# Altium schematic sheet Memory.SchDoc
size A3; SheetNumber: 6; SheetTotal: 13
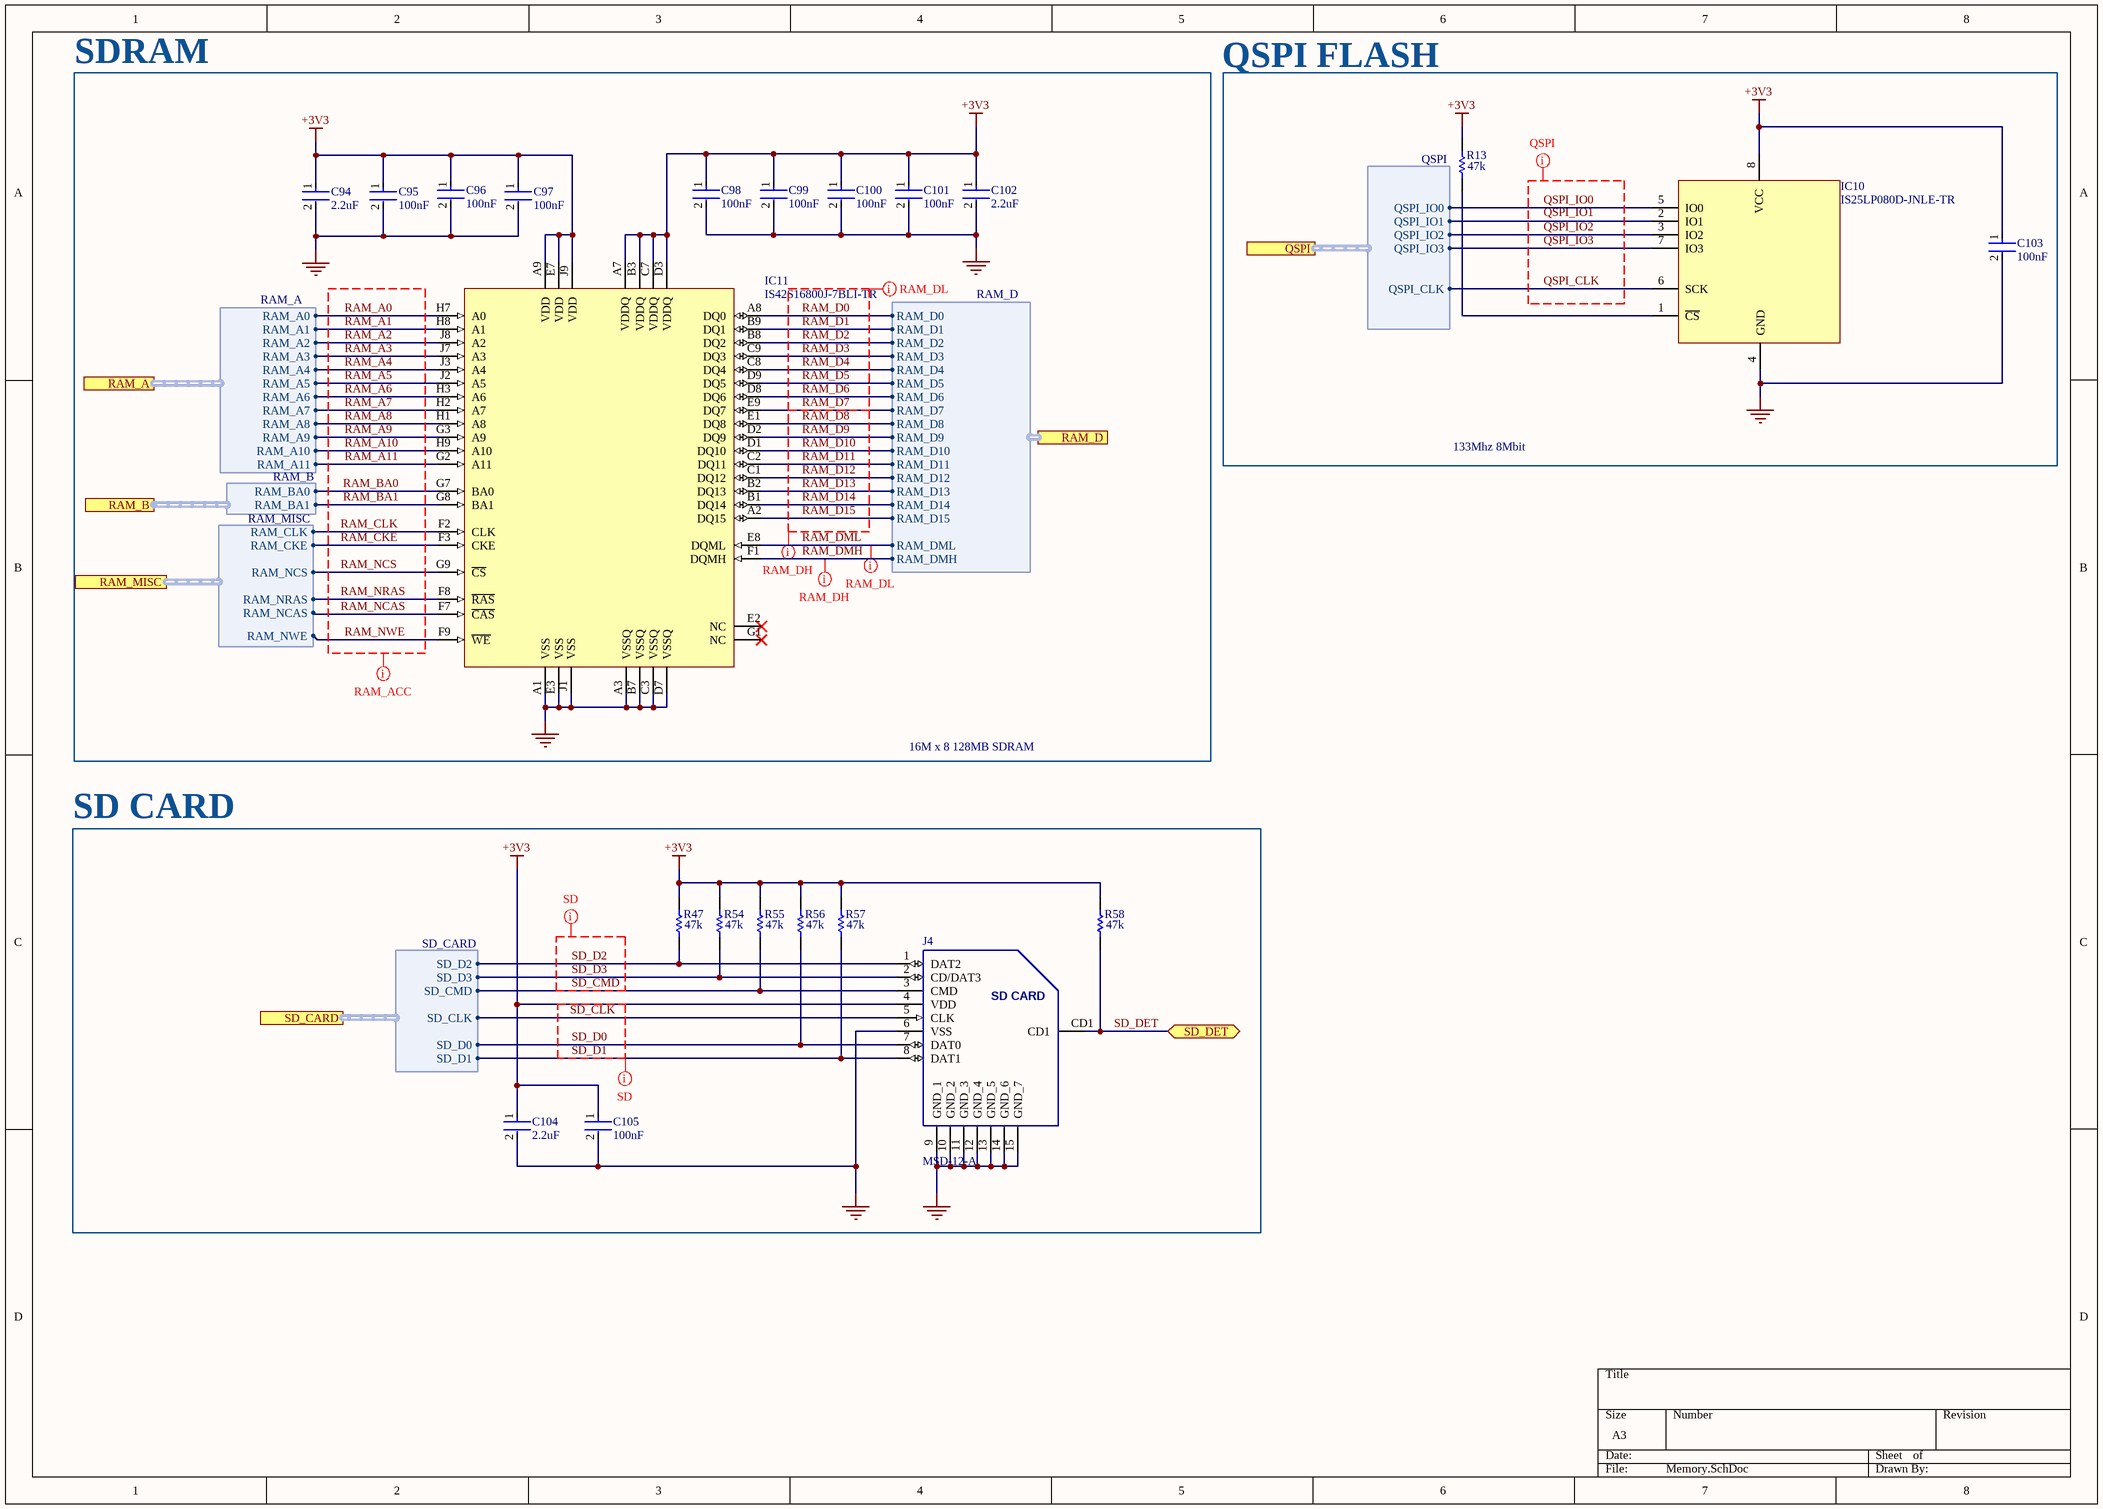
[diagram p0: Memory.SchDoc]

## Parts
C94  Capacitance: 2.2uF  [FP-GCH188-0_1-e0_2_0_5-MFG]  (hidden comment: GCM188C71A225KE02D)
C95  Capacitance: 100nF  [FP-GCM155-0_05-IPC_A]  (hidden comment: GCM155R71H104ME02J)
C96  Capacitance: 100nF  [FP-GCM155-0_05-IPC_A]  (hidden comment: GCM155R71H104ME02J)
C97  Capacitance: 100nF  [FP-GCM155-0_05-IPC_A]  (hidden comment: GCM155R71H104ME02J)
C98  Capacitance: 100nF  [FP-GCM155-0_05-IPC_A]  (hidden comment: GCM155R71H104ME02J)
C99  Capacitance: 100nF  [FP-GCM155-0_05-IPC_A]  (hidden comment: GCM155R71H104ME02J)
C100  Capacitance: 100nF  [FP-GCM155-0_05-IPC_A]  (hidden comment: GCM155R71H104ME02J)
C101  Capacitance: 100nF  [FP-GCM155-0_05-IPC_A]  (hidden comment: GCM155R71H104ME02J)
C102  Capacitance: 2.2uF  [FP-GCH188-0_1-e0_2_0_5-MFG]  (hidden comment: GCM188C71A225KE02D)
C103  Capacitance: 100nF  [FP-GCM155-0_05-IPC_A]  (hidden comment: GCM155R71H104ME02J)
C104  Capacitance: 2.2uF  [FP-GCH188-0_1-e0_2_0_5-MFG]  (hidden comment: GCM188C71A225KE02D)
C105  Capacitance: 100nF  [FP-GCM155-0_05-IPC_A]  (hidden comment: GCM155R71H104ME02J)
IC10  IS25LP080D-JNLE-TR  [SOIC127P600X175-8N]
IC11  IS42S16800J-7BLI-TR  [IS42S16800J-7BLI-TR]
J4  MSD-12-A  [MSD12A]
R13  Resistance: 47k  [RESC1005X40X25LL05T10]  (hidden comment: RC0402JR-0747KL)
R47  Resistance: 47k  [RESC1005X40X25LL05T10]  (hidden comment: RC0402JR-0747KL)
R54  Resistance: 47k  [RESC1005X40X25LL05T10]  (hidden comment: RC0402JR-0747KL)
R55  Resistance: 47k  [RESC1005X40X25LL05T10]  (hidden comment: RC0402JR-0747KL)
R56  Resistance: 47k  [RESC1005X40X25LL05T10]  (hidden comment: RC0402JR-0747KL)
R57  Resistance: 47k  [RESC1005X40X25LL05T10]  (hidden comment: RC0402JR-0747KL)
R58  Resistance: 47k  [RESC1005X40X25LL05T10]  (hidden comment: RC0402JR-0747KL)

## Blocks framed on the sheet
SDRAM: C94-C102 IC11
QSPI FLASH: C103 IC10 R13
SD CARD: C104 C105 J4 R47 R54-R58

## Ports
QSPI (harness QSPI, see high_level[3A], MCU_Connections[4B]), RAM_A (harness RAM_A, see high_level[3A], MCU_Connections[2B]), RAM_B (harness RAM_B, see high_level[3A], MCU_Connections[2C]), RAM_D (harness RAM_D, see high_level[3A], MCU_Connections[2D]), RAM_MISC (harness RAM_MISC, see high_level[3A], MCU_Connections[2C]), SD_CARD (harness SD_CARD, see high_level[3A], MCU_Connections[4C]), SD_DET (bidir, see high_level[3A], MCU_Connections[5C])

## Harnesses
RAM_D: RAM_D0, RAM_D1, RAM_D2, RAM_D3, RAM_D4, RAM_D5, RAM_D6, RAM_D7, RAM_D8, RAM_D9, RAM_D10, RAM_D11, RAM_D12, RAM_D13, RAM_D14, RAM_D15, RAM_DML, RAM_DMH
RAM_A: RAM_A0, RAM_A1, RAM_A2, RAM_A3, RAM_A4, RAM_A5, RAM_A6, RAM_A7, RAM_A8, RAM_A9, RAM_A10, RAM_A11
RAM_B: RAM_BA0, RAM_BA1
RAM_MISC: RAM_CLK, RAM_CKE, RAM_NCS, RAM_NRAS, RAM_NCAS, RAM_NWE
SD_CARD: SD_D2, SD_D3, SD_CMD, SD_CLK, SD_D0, SD_D1
QSPI: QSPI_IO0, QSPI_IO1, QSPI_IO2, QSPI_IO3, QSPI_CLK

## Nets
+3V3: C94.1 C95.1 C96.1 C97.1 C98.1 C99.1 C100.1 C101.1 C102.1 C103.1 C104.1 C105.1 IC10.8(VCC) IC11.A7(VDDQ) IC11.A9(VDD) IC11.B3(VDDQ) IC11.C7(VDDQ) IC11.D3(VDDQ) IC11.E7(VDD) IC11.J9(VDD) J4.4(VDD) R13.2 R47.2 R54.2 R55.2 R56.2 R57.2 R58.2
GND: C94.2 C95.2 C96.2 C97.2 C98.2 C99.2 C100.2 C101.2 C102.2 C103.2 C104.2 C105.2 IC10.4(GND) IC11.A1(VSS) IC11.A3(VSSQ) IC11.B7(VSSQ) IC11.C3(VSSQ) IC11.D7(VSSQ) IC11.E3(VSS) IC11.J1(VSS) J4.6(VSS) J4.9(GND_1) J4.10(GND_2) J4.11(GND_3) J4.12(GND_4) J4.13(GND_5) J4.14(GND_6) J4.15(GND_7)
QSPI_CLK: IC10.6(SCK) ; port QSPI.QSPI_CLK
QSPI_IO0: IC10.5(IO0) ; port QSPI.QSPI_IO0
QSPI_IO2: IC10.3(IO2) ; port QSPI.QSPI_IO2
QSPI_IO3: IC10.7(IO3) ; port QSPI.QSPI_IO3
RAM_A0: IC11.H7(A0) ; port RAM_A.RAM_A0
RAM_A1: IC11.H8(A1) ; port RAM_A.RAM_A1
RAM_A2: IC11.J8(A2) ; port RAM_A.RAM_A2
RAM_A3: IC11.J7(A3) ; port RAM_A.RAM_A3
RAM_A4: IC11.J3(A4) ; port RAM_A.RAM_A4
RAM_A5: IC11.J2(A5) ; port RAM_A.RAM_A5
RAM_A6: IC11.H3(A6) ; port RAM_A.RAM_A6
RAM_A7: IC11.H2(A7) ; port RAM_A.RAM_A7
RAM_A8: IC11.H1(A8) ; port RAM_A.RAM_A8
RAM_A9: IC11.G3(A9) ; port RAM_A.RAM_A9
RAM_A10: IC11.H9(A10) ; port RAM_A.RAM_A10
RAM_A11: IC11.G2(A11) ; port RAM_A.RAM_A11
RAM_BA0: IC11.G7(BA0) ; port RAM_B.RAM_BA0
RAM_BA1: IC11.G8(BA1) ; port RAM_B.RAM_BA1
RAM_CKE: IC11.F3(CKE) ; port RAM_MISC.RAM_CKE
RAM_CLK: IC11.F2(CLK) ; port RAM_MISC.RAM_CLK
RAM_D0: IC11.A8(DQ0) ; port RAM_D.RAM_D0
RAM_D1: IC11.B9(DQ1) ; port RAM_D.RAM_D1
RAM_D2: IC11.B8(DQ2) ; port RAM_D.RAM_D2
RAM_D3: IC11.C9(DQ3) ; port RAM_D.RAM_D3
RAM_D4: IC11.C8(DQ4) ; port RAM_D.RAM_D4
RAM_D5: IC11.D9(DQ5) ; port RAM_D.RAM_D5
RAM_D6: IC11.D8(DQ6) ; port RAM_D.RAM_D6
RAM_D7: IC11.E9(DQ7) ; port RAM_D.RAM_D7
RAM_D8: IC11.E1(DQ8) ; port RAM_D.RAM_D8
RAM_D9: IC11.D2(DQ9) ; port RAM_D.RAM_D9
RAM_D10: IC11.D1(DQ10) ; port RAM_D.RAM_D10
RAM_D11: IC11.C2(DQ11) ; port RAM_D.RAM_D11
RAM_D12: IC11.C1(DQ12) ; port RAM_D.RAM_D12
RAM_D13: IC11.B2(DQ13) ; port RAM_D.RAM_D13
RAM_D14: IC11.B1(DQ14) ; port RAM_D.RAM_D14
RAM_D15: IC11.A2(DQ15) ; port RAM_D.RAM_D15
RAM_DMH: IC11.F1(DQMH) ; port RAM_D.RAM_DMH
RAM_DML: IC11.E8(DQML) ; port RAM_D.RAM_DML
RAM_NCAS: IC11.F7(~{CAS}) ; port RAM_MISC.RAM_NCAS
RAM_NCS: IC11.G9(~{CS}) ; port RAM_MISC.RAM_NCS
RAM_NRAS: IC11.F8(~{RAS}) ; port RAM_MISC.RAM_NRAS
RAM_NWE: IC11.F9(~{WE}) ; port RAM_MISC.RAM_NWE
SD_CLK: J4.5(CLK) ; port SD_CARD.SD_CLK
SD_CMD: J4.3(CMD) R55.1 ; port SD_CARD.SD_CMD
SD_D0: J4.7(DAT0) R56.1 ; port SD_CARD.SD_D0
SD_D1: J4.8(DAT1) R57.1 ; port SD_CARD.SD_D1
SD_D2: J4.1(DAT2) R47.1 ; port SD_CARD.SD_D2
SD_D3: J4.2(CD/DAT3) R54.1 ; port SD_CARD.SD_D3
SD_DET: J4.CD1 R58.1 ; port SD_DET
NetIC10_1: IC10.1(~{CS}) R13.1
NetIC10_2: IC10.2(IO1) ; port QSPI.QSPI_IO1

Not connected (* = marked no-connect by the designer): IC11 E2(NC)* G1(NC)*

## Layout directives
mark named RAM_ACC: RAM_A0, RAM_A1, RAM_A2, RAM_A3, RAM_A4, RAM_A5, RAM_A6, RAM_A7, RAM_A8, RAM_A9, RAM_A10, RAM_A11, RAM_BA0, RAM_BA1, RAM_CKE, RAM_CLK, RAM_NCAS, RAM_NCS, RAM_NRAS, RAM_NWE
mark named RAM_DL: RAM_D0, RAM_D1, RAM_D2, RAM_D3, RAM_D4, RAM_D5, RAM_D6, RAM_D7, RAM_DML
mark named RAM_DH: RAM_D7, RAM_D8, RAM_D9, RAM_D10, RAM_D11, RAM_D12, RAM_D13, RAM_D14, RAM_D15, RAM_DMH
mark named QSPI: QSPI_CLK, QSPI_IO0, QSPI_IO1, QSPI_IO2, QSPI_IO3
mark named SD: SD_CMD, SD_D1, SD_D2, SD_D3

## Notes on the sheet
- 133Mhz 8Mbit
- 16M x 8 128MB SDRAM
- Labels drawn without touching a wire or pin: QSPI_IO1
- (in symbol MSD-12-A) SD CARD

## Library data of the parts
C94 C102 C104 = CMP-00260-57357036-1: GCM188C71A225KE02D Multilayer Ceramic Capacitor, 2.2 uF, 10 V, ± 10%, X7S, 0603 [1608 Metric]; NexarPartId: 57357036; RoHS: Non-Compliant; Lifecycle Status: Production
C95-C101 C103 C105 = CMP-06035-028957-1: Ceramic Capacitor for Automotive 100nF ±20% 50VDC X7R 0402 Paper T/R
IC10 = IS25LP080D-JNLE-TR: Integrated Circuit; Manufacturer_Name: Integrated Silicon Solution Inc.; Datasheet Link: https://www.mouser.com/datasheet/2/198/25LP-WP080D-1003192.pdf; Height: 1.75mm; Manufacturer_Part_Number: IS25LP080D-JNLE-TR; Mouser Part Number: 870-IS25LP080DJNLETR; Mouser Price/Stock: https://www.mouser.co.uk/ProductDetail/ISSI/IS25LP080D-JNLE-TR?qs=pif5%252B9MYt0VkH9msMJ5aTQ%3D%3D; Arrow Part Number: IS25LP080D-JNLE-TR; Arrow Price/Stock: https://www.arrow.com/en/products/is25lp080d-jnle-tr/integrated-silicon-solution-inc?region=nac
IC11 = IS42S16800J-7BLI-TR: Integrated Circuit; Manufacturer_Name: Integrated Silicon Solution Inc.; Datasheet Link: https://www.mouser.be/datasheet/2/198/42_45S81600J_16800J-3460583.pdf; Height: 1.2mm; Manufacturer_Part_Number: IS42S16800J-7BLI-TR
J4 = MSD-12-A: Connector; Manufacturer_Name: Same Sky; Datasheet Link: https://www.sameskydevices.com/product/resource/MSD-12-A.pdf; Height: 1.6mm; Manufacturer_Part_Number: MSD-12-A; Mouser Part Number: 179-MSD-12-A; Mouser Price/Stock: https://www.mouser.co.uk/ProductDetail/Same-Sky/MSD-12-A?qs=Z%252BL2brAPG1KTGgvYejyeAQ%3D%3D; Arrow Part Number: MSD-12-A; Arrow Price/Stock: https://www.arrow.com/en/products/msd-12-a/cui-devices?utm_currency=USD&region=nac
R13 R47 R54-R58 = CMP-1011-00114-2: Manufacturer: Yageo / Phycomp; Part Number: RC0402JR-0747KL